# Altium project BAVA-Solutions.PrjPcb
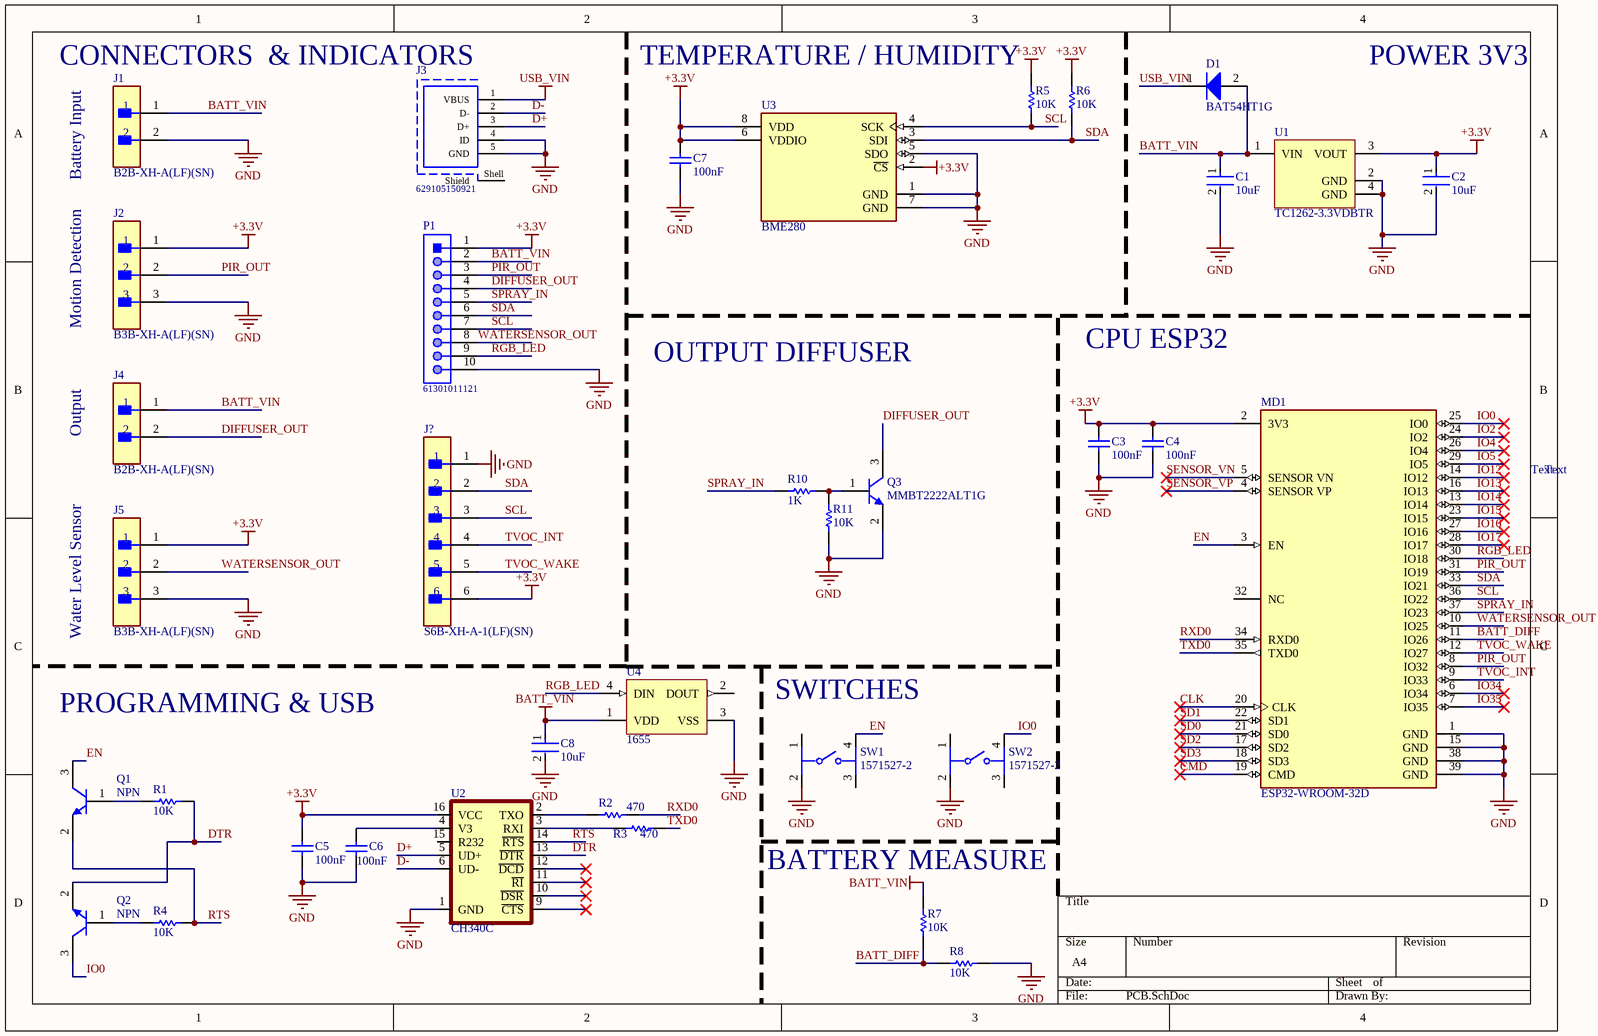
[diagram p0: PCB.SchDoc]
1 sheet, 36 parts. Net scope: global (net labels, ports and power ports of the same name join across sheets).
Board file: PCB1.PcbDoc

## Sheet PCB.SchDoc
size A4; SheetNumber: 1; SheetTotal: 1

### Parts
C1  10uF  [FP-GRM188-0_1-e0_2_0_55-IPC_C]
C2  10uF  [FP-GRM188-0_1-e0_2_0_55-IPC_C]
C3  100nF  [CAPC1608X90X35ML10T15]
C4  100nF  [CAPC1608X90X35ML10T15]
C5  100nF  [CAPC1608X90X35ML10T15]
C6  100nF  [CAPC1608X90X35ML10T15]
C7  100nF  [CAPC1608X90X35ML10T15]
C8  10uF  [FP-GRM188-0_1-e0_2_0_55-IPC_C]
D1  BAT54HT1G  [ONSC-SOD-323-2-477-02_V]
J1  B2B-XH-A(LF)(SN)  [FP-B2B-XH-A_LF_SN-MFG]
J2  B3B-XH-A(LF)(SN)  [FP-B3B-XH-A_LF_SN-MFG]
J3  629105150921  [629105150921]
J4  B2B-XH-A(LF)(SN)  [FP-B2B-XH-A_LF_SN-MFG]
J5  B3B-XH-A(LF)(SN)  [FP-B3B-XH-A_LF_SN-MFG]
J?  S6B-XH-A-1(LF)(SN)  [FP-S6B-XH-A-1_LF_SN-MFG]
MD1  ESP32-WROOM-32D  [FP-ESP32-WROOM-32D-MFG]
P1  61301011121  [61301011121]
Q1  NPN  [ONSC-SOT-23-3-318-08_V]
Q2  NPN  [ONSC-SOT-23-3-318-08_V]
Q3  MMBT2222ALT1G  [ONSC-SOT-23-3-318-08_V]
R1  10K  [RESC1609X55X30LL15T15]
R2  470  [RESC1609X55X30LL15T15]
R3  470  [RESC1609X55X30LL15T15]
R4  10K  [RESC1609X55X30LL15T15]
R5  10K  [RESC1609X55X30LL15T15]
R6  10K  [RESC1609X55X30LL15T15]
R7  10K  [RESC1609X55X30LL15T15]
R8  10K  [RESC1609X55X30LL15T15]
R10  1K  [RESC1609X55X30LL15T15]
R11  10K  [RESC1609X55X30LL15T15]
SW1  1571527-2  [FP-1571527-2-MFG]
SW2  1571527-2  [FP-1571527-2-MFG]
U1  TC1262-3.3VDBTR  [SOT-223-DB3_L]
U2  CH340C  [SO016]
U3  BME280  [FP-BME280-MFG]
U4  1655  [ADA-RGB-1655_V]

### Nets
+3.3V: C2.1 C3.2 C4.2 C5.2 C7.2 J2.1 J5.1 J?.6 MD1.2(3V3) P1.1 R5.2 R6.2 U1.3(VOUT) U2.16(VCC) U3.2(~{CS}) U3.6(VDDIO) U3.8(VDD)
BATT_VIN: C1.1 C8.1 D1.2(A) J1.1 J4.1 P1.2 R7.2 U1.1(VIN) U4.1(VDD)
GND: C1.2 C2.2 C3.1 C4.1 C5.1 C6.1 C7.1 C8.2 J1.2 J2.3 J3.4(ID) J3.5(GND) J5.3 J?.1 MD1.1(GND) MD1.15(GND) MD1.38(GND) MD1.39(GND) P1.10 Q3.2(E) R8.2 R11.1 SW1.2 SW2.2 U1.2(GND) U1.4(GND) U2.1(GND) U3.1(GND) U3.5(SDO) U3.7(GND) U4.3(VSS)
USB_VIN: D1.1(K) J3.1(VBUS)
BATT_DIFF: MD1.11(IO26) R7.1 R8.1
CLK: MD1.20(CLK)
CMD: MD1.19(CMD)
D+: J3.3(D+) U2.5(UD+)
D-: J3.2(D-) U2.6(UD-)
DIFFUSER_OUT: J4.2 P1.4 Q3.3(C)
DTR: Q2.2(E) R1.2 U2.13(~{DTR})
EN: MD1.3(EN) Q1.3(C) SW1.4
IO0: MD1.25(IO0) Q2.3(C) SW2.4
IO2: MD1.24(IO2)
IO4: MD1.26(IO4)
IO5: MD1.29(IO5)
IO12: MD1.14(IO12)
IO13: MD1.16(IO13)
IO14: MD1.13(IO14)
IO15: MD1.23(IO15)
IO16: MD1.27(IO16)
IO17: MD1.28(IO17)
IO34: MD1.6(IO34)
IO35: MD1.7(IO35)
PIR_OUT: J2.2 MD1.8(IO32) MD1.31(IO19) P1.3
RGB_LED: MD1.30(IO18) P1.9 U4.4(DIN)
RTS: Q1.2(E) R4.2 U2.14(~{RTS})
RXD0: MD1.34(RXD0) R2.2
SCL: J?.3 MD1.36(IO22) P1.7 R5.1 U3.4(SCK)
SD0: MD1.21(SD0)
SD1: MD1.22(SD1)
SD2: MD1.17(SD2)
SD3: MD1.18(SD3)
SDA: J?.2 MD1.33(IO21) P1.6 R6.1 U3.3(SDI)
SENSOR_VN: MD1.5(SENSOR_VN)
SENSOR_VP: MD1.4(SENSOR_VP)
SPRAY_IN: MD1.37(IO23) P1.5 R10.2
TVOC_INT: J?.4 MD1.9(IO33)
TVOC_WAKE: J?.5 MD1.12(IO27)
TXD0: MD1.35(TXD0) R3.2
WATERSENSOR_OUT: J5.2 MD1.10(IO25) P1.8
NetC6_2: C6.2 U2.4(V3)
NetQ1_1: Q1.1(B) R1.1
NetQ2_1: Q2.1(B) R4.1
NetQ3_1: Q3.1(B) R10.1 R11.2
NetR2_1: R2.1 U2.2(TXO)
NetR3_1: R3.1 U2.3(RXI)

Not connected (* = marked no-connect by the designer): J3 Shell(Shield); MD1 32(NC); SW1 1 3; SW2 1 3; U2 9(~{CTS})* 10(~{DSR})* 11(~{RI})* 12(~{DCD})* 15(R232); U4 2(DOUT)

### Notes on the sheet
- (near J1) CONNECTORS  & INDICATORS
- TEMPERATURE / HUMIDITY
- POWER 3V3
- Battery Input
- Motion Detection
- OUTPUT DIFFUSER
- CPU ESP32
- Output
- Text
- Water Level Sensor
- PROGRAMMING & USB
- SWITCHES
- (near R7) BATTERY MEASURE

### Library data of the parts
C1 C2 C8 = CMP-2006-02792-2: Chip Multilayer Ceramic Capacitors for General Purpose, 0603, 10uF, X5R, 15%, 20%, 6.3V; Packaging: Tape and Reel; Voltage Rating (DC): 6.3V; Width: 0.031inch; Termination: SMD/SMT; Dielectric: X5R; Package Quantity: 4000; Voltage Rating: 6.3V; Capacitance: 10uF; Case/Package: 0603; Min Operating Temperature: -55°C; Voltage: 6.3V; Length: 1.6mm; Thickness: 0.035inch; Lead Free: Lead Free; Depth: 0.8mm; Case Code (Imperial): 0603; Max Operating Temperature: 85°C; Material: Ceramic; Height: 0.8mm; Tolerance: 20%; Mount: Surface Mount; REACH SVHC: No SVHC; Radiation Hardening: No; Case Code (Metric): 1608
C3-C7 = CMP-2100-03643-1: Chip Capacitor, 0.1 uF, +/- 10%, 50 V, -55 to 125 degC, 0603 (1608 Metric), RoHS, Tape and Reel; Manufacturer: Murata; Dielectric Material: Ceramic; Voltage Rating: 50V; Dielectric: X7R; Insulation Resistance: 10GR; Case Code (Metric): 1608; Lead Free: LeadFree; Depth: 0.8mm; Number of Pins: 2; Radiation Hardening: No; Case/Package: 0603; Manufacturer URL: http://www.murata.com/; Packaging: TapeandReel; Length: 1.6mm; Contact Plating: Tin; Datasheet URL: http://psearch.en.murata.com/capacitor/product/GRM188R71H104KA93%23.pdf; Tolerance: 10%; Case Code (Imperial): 0603; Min Operating Temperature: -55degC; RoHSCompliant: true; Capacitance: 100nF; Voltage: 50V; Termination: SMD/SMT; Mount: SurfaceMount; Material: Ceramic; Package Quantity: 1; Height: 0.8mm; Thickness: 0.035inch; REACH SVHC: NoSVHC; Max Operating Temperature: 125degC; Width: 0.8mm; Package Reference: 0603; Voltage Rating (DC): 50V; Datasheet Version: 42675.0; Package Description: 2-Pin Surface Mount Device, Body 1.6 x 0.8 mm
D1 = CMP-1055-00462-1: Schottky Barrier Diode, 2-Pin SOD-323, Pb-Free, Tape and Reel; Manufacturer: On Semiconductor; Configuration: Single; trr Max (ns): 5; IFSM Max (A): 0.6; ComponentLink3URL: http://www.onsemi.com/pub_link/Collateral/477-02.PDF.1; PackageDescription: 2-Pin SOD, Body 1.7 x 1.25 mm; ComponentLink2URL: http://www.onsemi.cn/pub_link/Collateral/BAT54HT1-D.PDF; ComponentLink3Description: Package Specification; ComponentLink2Description: Datasheet; DatasheetVersion: Rev. 6; PackageReference: SOD-323-2-477-02; RoHS: TRUE; ComponentLink1URL: http://www.onsemi.com/; Packing: Tape and Reel; PartNumber: BAT54HT1G; Mounting Technology: Surface Mount; ComponentLink1Description: Manufacturer URL; PackageVersion: Rev. H, 03/2007
J1 J4 = CMP-2000-05888-3: CONN HEADER VERT 2POS 2.5MM; Current Rating: 3A; Voltage Rating: 250V; Number of Contacts: 2; Contact Resistance: 20mR; Wire/Cable Gauge: 22AWG; Insulation Resistance: 1GR; Connector Type: Male Pin; Packaging: Bulk; Contact Material: Brass; Lead Free: Lead Free; Orientation: Straight; Contact Plating: Tin; Max Current Rating: 3A; Termination: Solder; Fastening Type: Detent; Depth: 5.75mm; Housing Material: Polyamide; REACH SVHC: No SVHC; Series: XH; Voltage Rating (AC): 250V; Number of Positions: 2; Color: Natural; Contact Type: Male Pin; Max Voltage Rating (DC): 250V; Pitch: 2.5mm; Lead Pitch: 2.5mm; Mount: Through Hole; Max Operating Temperature: 85°C; Length: 7.4mm; Max Voltage Rating (AC): 250V; Min Operating Temperature: -25°C; Number of Rows: 1; Housing Color: White
J2 J5 = CMP-17439-000014-2: CONN HEADER VERT 3POS 2.5MM; Number of Positions: 3; Contact Resistance: 20mR; Max Current Rating: 3A; Gender: Male; Wire/Cable Gauge: 22AWG; Insulation Resistance: 1GR; Max Voltage Rating (DC): 250V; REACH SVHC: No SVHC; Lead Free: Lead Free; Packaging: Bulk; Pitch: 2.5mm; Housing Color: White; Number of Rows: 1; Housing Material: Polyamide; Termination: Solder; Series: XH; Fastening Type: Detent; Contact Plating: Tin; Contact Finish - Mating: TIN; Insulation Material: Nylon; Number of Contacts: 3; Max Operating Temperature: 85°C; Color: Natural; Contact Type: Male Pin; Mount: Through Hole; Current Rating: 3A; Orientation: Straight; Min Operating Temperature: -25°C; Connector Type: Header; Lead Pitch: 2.5mm; Contact Material: Brass; Length: 9.9mm; Insulation Color: Natural; Voltage Rating (AC): 250V; Max Voltage Rating (AC): 250V; Contact Shape: Square; Flammability Rating: UL94 V-0; Depth: 5.75mm; Voltage Rating: 250V
J3 = CMP-1502-03249-1: Micro USB 2.0 Type AB Receptacle WR-COM, Horizontal, SMT; Manufacturer: Wurth Elektronik; Rated Current: 1.8A; Contact Resistance: 30mOhm; Working Voltage: 30VAC; Publisher: WurthElektronik; Part Number: 629105150921; Operating Temperature: -40to85degC; Gender: Receptacle; Packaging: TapeandReel; Connector Type: MicroUSB2.0TypeAB; Datasheet URL: https://katalog.we-online.de/em/datasheet/629105150921.pdf; Mounting Technology: SMT; Orientation: Horizontal; Package Reference: 629105150921; Manufacturer URL: http://www.we-online.de
J? = CMP-17439-000023-1: CONN HEADER R/A P6OS 2.5MM; Voltage Rating: 250V; Insulation Resistance: 1GR; Current Rating: 3A; Number of Positions: 6; Gender: Male; Mount: Through Hole; Material: Polyamide; Max Operating Temperature: 85°C; Contact Plating: Tin; Number of Rows: 1; Color: Natural; Termination: Crimp; Min Operating Temperature: -25°C; Pitch: 2.5mm; Lead Free: Lead Free; Contact Material: Brass
MD1 = CMP-194065-000003-1: WIFI MODULE 32MBITS SPI FLASH; Manufacturer: Espressif Systems; Max Supply Voltage: 3.6V; Nominal Supply Current: 500mA; Max Frequency: 2484MHz; Number Of Adc Channels: 16; Number Of Gpio: 32; Interface: I2C,SPI,UART,Ethernet,I2S,Other; Data Rate: 150Mbits/s; Min Supply Voltage: 3V; Bandwidth: 72MHz; Sensitivity: -98dBm; Octopart: https://octopart.com/esp32-wroom-32d-espressif+systems-91040050; Package: ESP32-WROOM-32D; ComponentLink2URL: https://www.espressif.com/sites/default/files/documentation/esp32-wroom-32d_esp32-wroom-32u_datasheet_en.pdf; Lead Free: Yes; Category: UNK; Mouser Description: Wi-Fi/BT BLE Module ESP32-D0WD, SPI Flash, UART, P; Device Class L1: Integrated Circuits (ICs); RoHS: TRUE; Temperature Range Low: -40°C; ComponentLink2Description: Datasheet; Digikey Description: WIFI MODULE 32MBITS SPI FLASH; Height: 3.2mm; Temperature: -40°C to +85°C; Manufacturer Part Number: ESP32-WROOM-32D; Device Class L3: Transceivers; Device Class L2: RF Semiconductors and Devices; Temperature Range High: +85°C; Automotive: No
P1 = CMP-1502-01082-1: THT Vertical Pin Header WR-PHD, Pitch 2.54 mm, Single Row, 10 pins; Manufacturer: Wurth Elektronik; Contact Resistance: 20mOhm; Rated Current: 3A; Pitch: 2.54mm; Gender: Male; Pin Number: 10; Working Voltage: 250VAC; Withstanding Voltage: 500VAC; Manufacturer URL: http://www.we-online.de; Operating Temperature: -40to105degC; Datasheet URL: https://katalog.we-online.de/em/datasheet/6130xx11121.pdf; Row Number: Single; Orientation: Vertical; Part Number: 61301011121; Packaging: Bag; Package Reference: 61301011121; Mounting Technology: THT; Publisher: WurthElektronik
Q1 Q2 = CMP-1048-00662-1: High Voltage Transistor, NPN Silicon, 3-Pin SOT-23, Pb-Free, Tape and Reel; PartNumber: MMBTA42LT1G; Manufacturer: On Semiconductor; fT Min (MHz): 50; IC Continuous (A): 0.5; ComponentLink1URL: http://www.onsemi.com/; ComponentLink3URL: http://www.onsemi.cn/pub_link/Collateral/318-08.PDF; RoHS: TRUE; ComponentLink2Description: Datasheet; Polarity: NPN; DatasheetVersion: Rev. 12; PackageReference: SOT-23-3-318-08; PackageDescription: 3-Pin Small Outline Transistor, Body 2.92 x 1.3 mm, Pitch 0.95 mm; ComponentLink3Description: Package Specification; ComponentLink1Description: Manufacturer URL; Packing: Tape and Reel; PackageVersion: Rev. AP, 11/2009; Mounting Technology: Surface Mount; ComponentLink2URL: http://www.onsemi.cn/pub_link/Collateral/MMBTA42LT1-D.PDF
Q3 = CMP-1048-00538-1: General Purpose Transistor, NPN Silicon, 3-Pin SOT-23, Pb-Free, Tape and Reel; Manufacturer: On Semiconductor; fT Min (MHz): 300; IC Continuous (A): 0.6; ComponentLink3URL: http://www.onsemi.cn/pub_link/Collateral/318-08.PDF; PartNumber: MMBT2222ALT1G; RoHS: TRUE; ComponentLink1URL: http://www.onsemi.com/; ComponentLink3Description: Package Specification; ComponentLink2Description: Datasheet; Mounting Technology: Surface Mount; Packing: Tape and Reel; PackageDescription: 3-Pin Small Outline Transistor, Body 2.92 x 1.3 mm, Pitch 0.95 mm; DatasheetVersion: Rev. 10; PackageReference: SOT-23-3-318-08; ComponentLink2URL: http://www.onsemi.cn/pub_link/Collateral/MMBT2222LT1-D.PDF; Polarity: NPN; PackageVersion: Rev. AP, 11/2009; ComponentLink1Description: Manufacturer URL
R1-R8 R10 R11 = CMP-1012-00623-3: Chip Resistor, 10 KOhm, +/- 1%, 0.1 W, -55 to 155 degC, 0603 (1608 Metric), RoHS, Tape and Reel; Manufacturer: Panasonic; Voltage Rating: 75V; Case\/Package: 0603; Power Rating: 100mW; Resistance: 10KOhm; Temperature Coefficient: 100ppm\/degreesC; Number of Pins: 2; Package Reference: 603; Depth: 0.8mm; Mount: SurfaceMount; Package Description: 2-Pin Surface Mount Device, Body 1.6 x 0.85 mm; Datasheet Version: 02/2017; Length: 1.6mm; Lead Free: LeadFree; Height: 0.45mm; Number of Terminations: 2; Max Power Dissipation: 100mW; Min Operating Temperature: -55degC; Datasheet URL: https://industrial.panasonic.com/cdbs/www-data/pdf/RDA0000/AOA0000C304.pdf; Termination: SMD/SMT; Case Code (Metric): 1608; Case Code (Imperial): 0603; Tolerance: 1%; Max Operating Temperature: 155degC; RoHSCompliant: true; Voltage Rating (DC): 75V; Radiation Hardening: No; Packaging: TapeandReel; Composition: ThickFilm; Mounting Technology: SurfaceMount; Manufacturer URL: http://www.panasonic.com/; Width: 0.031inch; REACH SVHC: NoSVHC; Contact Plating: Tin; Military Standard: Not; Package Quantity: 1
SW1 SW2 = CMP-03402-000033-1: SWITCH TACTILE SPST-NO 0.05A 24V; Illumination Type: Non-Illuminated; Switch Travel: 0.25mm; Max Current Rating: 50mA; Actuator Type: Standard; Mechanical Life: 200000Cycles; Switch Function: Off-Mom; Actuator Length: 0.7mm; Actuator Material: Polyphenylene; Operating Force: 100gf; Throw Configuration: SPST; Series: FSMJSML, Alcoswitch; Depth: 10mm; Mount: Surface Mount; RoHS Compliant: Yes; Voltage Rating (DC): 24V; Contact Material: Copper Alloy; Case/Package: SMD/SMT; Material: Polyamide; Package Quantity: 1; Packaging: Tape and Reel; ELV: Compliant; Type: Switch; Min Operating Temperature: -35°C; Termination: Gull Wing; Length: 6mm; Orientation: Straight; Current Rating: 50mA; Height: 4.3mm; Max Operating Temperature: 85°C; REACH SVHC: No SVHC; Contact Plating: Silver
U1 = CMP-0136-00481-1: 500mA Fixed Output CMOS LDO, 3-Pin SOT-223, Extended Temperature, Tape and Reel; PackageVersion: revBB, Aug-2009; PackageDescription: 3-Lead Plastic Small Outline Transistor (DB) [SOT-223]; DatasheetVersion: revB, 2002; PackageReference: SOT-223-DB3
U2 = CH340C: USB to serial chip CH340; MF: WCH; Package: Package; Check_prices: https://www.snapeda.com/parts/CH340C/WCH/view-part/5428851/?ref=eda; Value: *; Price: None; MP: CH340C; Availability: Unavailable; SnapEDA_Link: https://www.snapeda.com/parts/CH340C/WCH/view-part/5428851/?ref=snap
U3 = CMP-2000-05073-3: SENSOR PRESSURE HUMIDITY TEMP; Sensor Type: Temperature; Accuracy: 3%; Response Time: 1s; Output Type: SPI; Min Operating Temperature: -40°C; Max Operating Temperature: 85°C; Case/Package: LGA; Packaging: Cut Tape; Mount: Surface Mount; Lead Free: Lead Free; Number of Pins: 8
U4 = CMP-2000-05026-1: Intelligent Control LED Integrated Light Source, 3.5 to 5.3 V, -25 to 80 degC, 4-Pin SMD, RoHS, Tape and Reel; Manufacturer: Adafruit-Industries-LLC; Number of LEDs: 10; Configuration: Discrete; Utilized LED: WS2812(5050); Datasheet URL: http://datasheet.octopart.com/ADA1655-Adafruit-Industries-datasheet-32028139.pdf; Series: Neopixel; Interface: -; Package Description: 4-Pin Surface Mount Device, Body 5 x 5 mm; Color: Red,Green,Blue(RGB); Category: Optoelectronics; Controller Type: -; Package Reference: 1655; Manufacturer URL: https://www.adafruit.com/; Mounting Type: SurfaceMount; Datasheet Version: May-13; Size / Dimension: 5.00mmLx5.00mmW; Family: Addressable,Specialty